# EAGLE design rauchmelder (EAGLE 6.3)
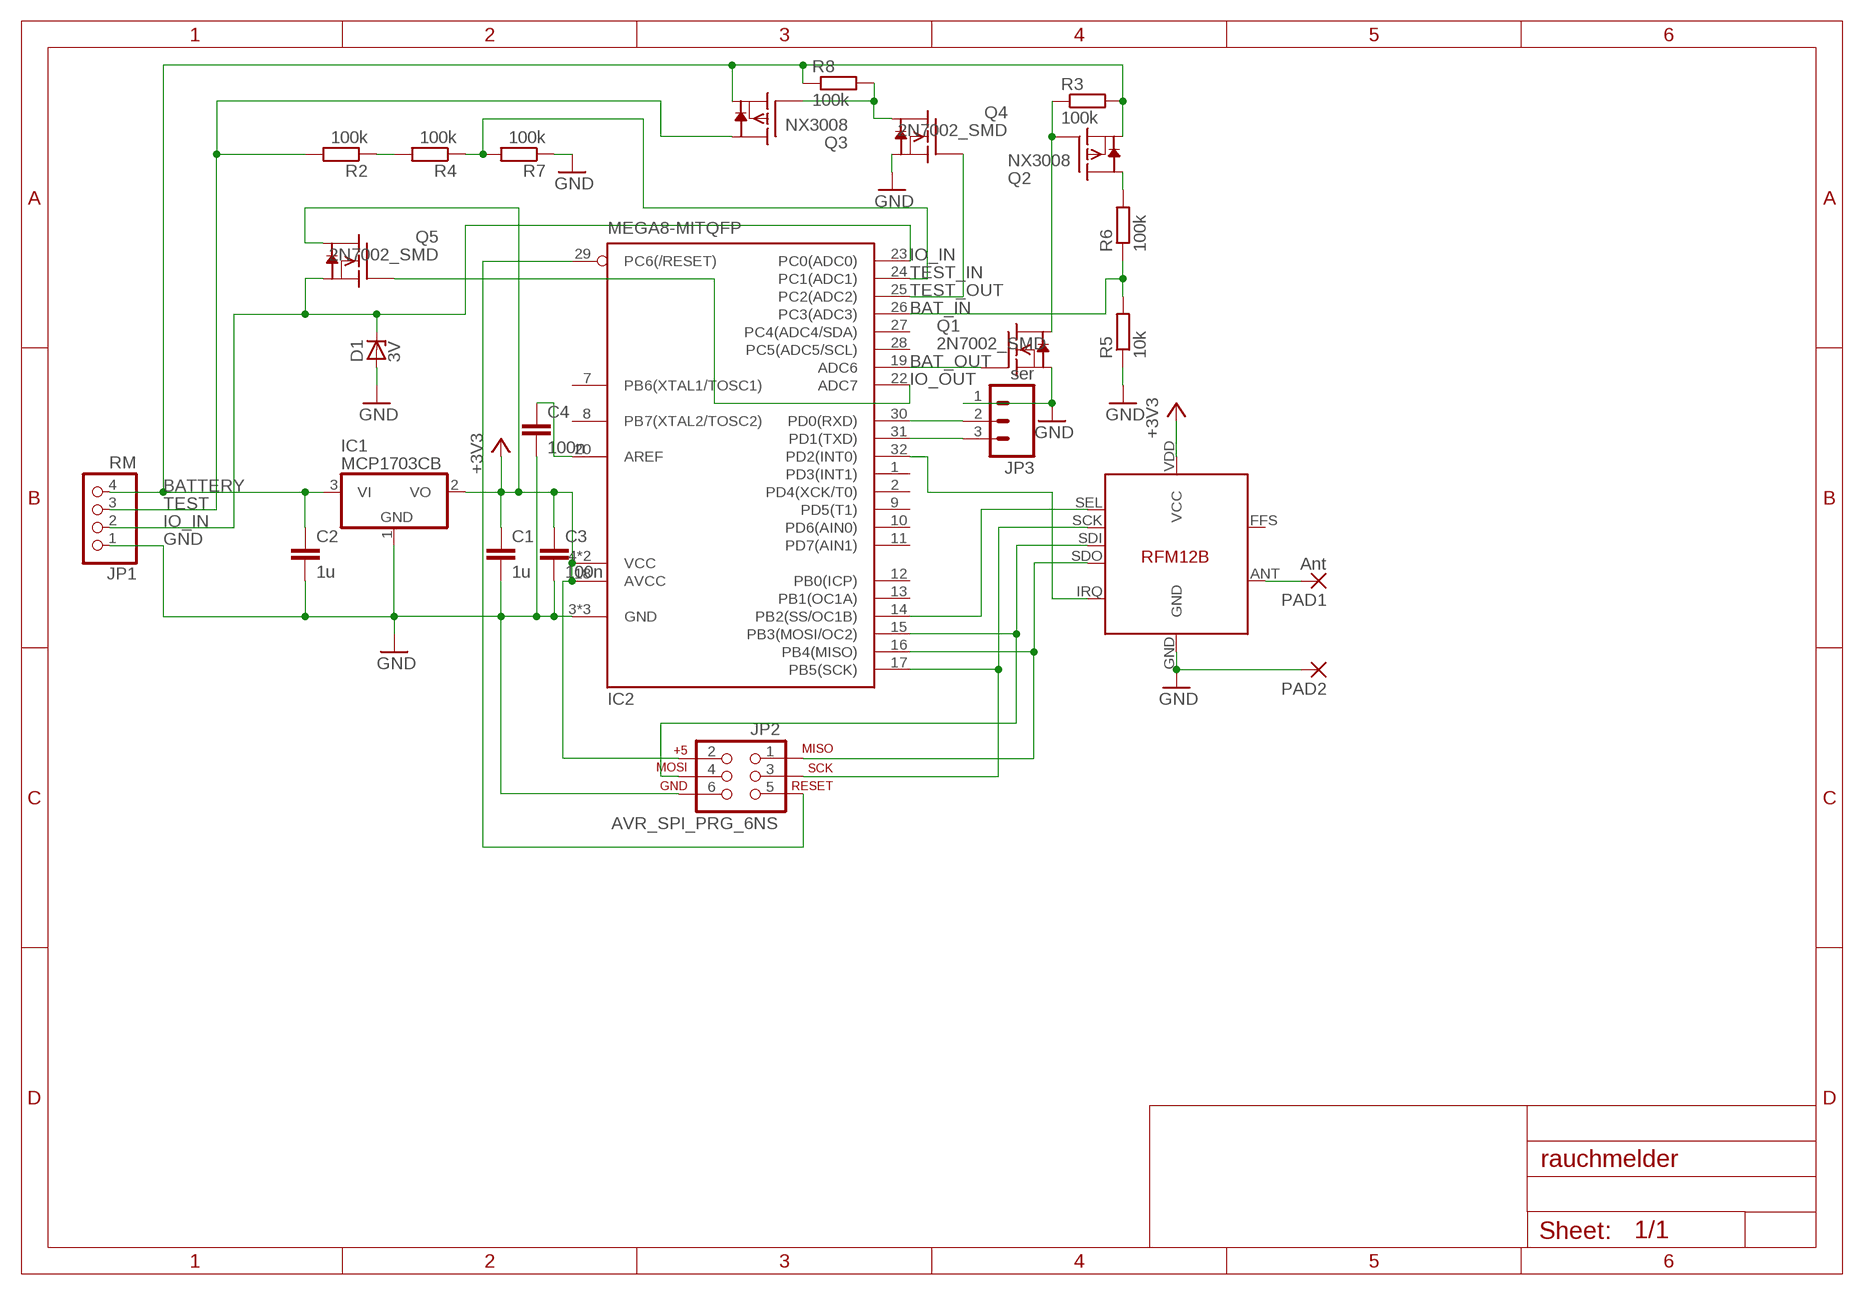
[diagram p0: schematic, sheet 1]

## Parts
C1  1u  C-EUC0603  [C0603]
C2  1u  C-EUC0603  [C0603]
C3  100n  C-EUC0603  [C0603]
C4  100n  C-EUC0603  [C0603]
D1  3V  ZENER-DIODESOD80C  [SOD80C]
IC1  MCP1703CB  [SOT23]
IC2  MEGA8-MITQFP  [TQFP32-08]
IC3  RFM12B  [RFM12B]
JP1  RM  PINHD-1X4  [1X04]
JP2  AVR_SPI_PRG_6NS  [2X3-NS]
JP3  ser  M03PTH  [1X03]
PAD1  Ant  1,6/0,8  [1,6/0,8]
PAD2  1,6/0,8  [1,6/0,8]
Q1  2N7002_SMD  [SOT23]
Q2  NX3008  [SOT23]
Q3  NX3008  [SOT23]
Q4  2N7002_SMD  [SOT23]
Q5  2N7002_SMD  [SOT23]
R2  100k  R-EU_R0603  [R0603]
R3  100k  R-EU_R0603  [R0603]
R4  100k  R-EU_R0603  [R0603]
R5  10k  R-EU_R0603  [R0603]
R6  100k  R-EU_R0603  [R0603]
R7  100k  R-EU_R0603  [R0603]
R8  100k  R-EU_R0603  [R0603]

## Nets
+3V3 [power]: C1.1 C3.1 IC1.2(VO) IC2.4(VCC) IC2.6(VCC) IC2.18(AVCC) IC3.VDD(VCC) JP2.2 Q5.3(D)
BAT_IN: IC2.26(PC3(ADC3)) R5.2 R6.1
BAT_OUT: IC2.19(ADC6) Q1.1(G)
BATTERY: C2.1 IC1.3(VI) JP1.4 Q2.2(S) Q3.2(S) R3.2 R8.1
GND [power]: C1.2 C2.2 C3.2 C4.2 D1.A IC1.1(GND) IC2.3(GND) IC2.5(GND) IC2.21(GND) IC3.GND JP1.1 JP2.6 JP3.1 PAD2.1(P) Q1.2(S) Q4.2(S) R5.1 R7.1
IO_IN: D1.C IC2.23(PC0(ADC0)) JP1.2 Q5.2(S)
IO_OUT: IC2.22(ADC7) Q5.1(G)
N$1: R2.1 R4.2
N$3: IC2.29(PC6(/RESET)) JP2.5
N$4: Q2.3(D) R6.2
N$5: IC2.16(PB4(MISO)) IC3.SDO JP2.1
N$6: IC2.15(PB3(MOSI/OC2)) IC3.SDI JP2.4
N$7: IC2.17(PB5(SCK)) IC3.SCK JP2.3
N$8: IC2.14(PB2(SS/OC1B)) IC3.SEL
N$9: IC2.32(PD2(INT0)) IC3.IRQ
N$11: Q1.3(D) Q2.1(G) R3.1
N$13: C4.1 IC2.20(AREF)
N$14: IC2.30(PD0(RXD)) JP3.2
N$15: IC2.31(PD1(TXD)) JP3.3
N$16: IC3.ANT PAD1.1(P)
N$17: Q3.1(G) Q4.3(D) R8.2
TEST: JP1.3 Q3.3(D) R2.2
TEST_IN: IC2.24(PC1(ADC1)) R4.1 R7.2
TEST_OUT: IC2.25(PC2(ADC2)) Q4.1(G)
Unconnected: IC2.1(PD3(INT1)) IC2.2(PD4(XCK/T0)) IC2.7(PB6(XTAL1/TOSC1)) IC2.8(PB7(XTAL2/TOSC2)) IC2.9(PD5(T1)) IC2.10(PD6(AIN0)) IC2.11(PD7(AIN1)) IC2.12(PB0(ICP)) IC2.13(PB1(OC1A)) IC2.27(PC4(ADC4/SDA)) IC2.28(PC5(ADC5/SCL)) IC3.FFS

## Library data of the parts
C1-C4 = rcl:C-EU: CAPACITOR, European symbol; OC_NEWARK: unknown
D1 = diode:ZENER-DIODE: Z-Diode; OC_FARNELL: 1757827
IC1 = rauchmelder:MCP1703: 250 mA, 16V, Low Quiescent Current LDO Regulator Source: http://ww1.microchip.com/downloads/en/DeviceDoc/22049b.pdf; OC_FARNELL: 1439518; OC_NEWARK: unknown
IC2 = rauchmelder:MEGA8-MI: MICROCONTROLLER 8 Kbytes FLASH, 1 kbytes SRAM, 512 bytes EEPROM, USART, 6-channel 10 bit ADC, 2-channel 8 bit ADC Pin compatible with Atmega48, ATMega88, ATMega168 Source: avr.lbr; OC_FARNELL: 1841614; OC_NEWARK: unknown
IC3 = rauchmelder:RFM12B; MPN: RFM12B-868-S1; OC_NEWARK: 40T1934
JP1 = pinhead:PINHD-1X4: PIN HEADER; OC_NEWARK: unknown
JP2 = rauchmelder:AVR_SPI_PRG_6: AVR ISP 6 Pin This is the reduced ISP connector for AVR programming. Common on Arduino. This footprint will take up less PCB space and can be used with a 10-pin to 6-pin adapter such as SKU: BOB-08508; OC_NEWARK: unknown
JP3 = rauchmelder:M03: Header 3 Standard 3-pin 0.1" header. Use with straight break away headers (SKU : PRT-00116), right angle break away headers (PRT-00553), swiss pins (PRT-00743), machine pins (PRT-00117), and female headers (PRT-00115). Molex polarized connector foot print use with SKU : PRT-08232 with associated crimp pins and housings.; OC_NEWARK: unknown
PAD1 PAD2 = rauchmelder:1,6/0,8: THROUGH-HOLE PAD; OC_NEWARK: unknown
Q1 Q4 Q5 = landroid:2N7002: N-Channel Enhancement MOSFET 60 V; 115 mA; 1.2…14 Ohm; OC_FARNELL: 1829184; OC_NEWARK: unknown
Q2 Q3 = rauchmelder:NX3008: Small P-channel MOSFET; MPN: NX3008NBK; OC_FARNELL: 2069541; OC_NEWARK: 75T7841
R2-R8 = rcl:R-EU_: RESISTOR, European symbol; OC_NEWARK: unknown

## Board
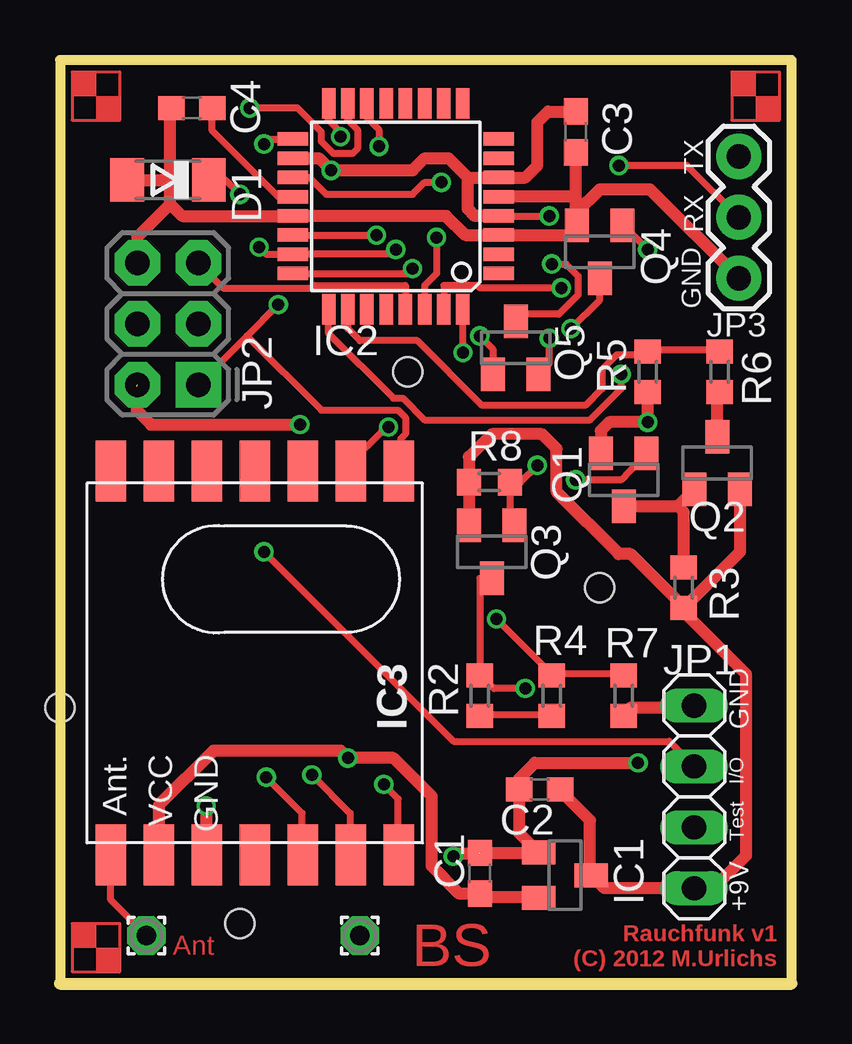
[diagram p1: board, top side]
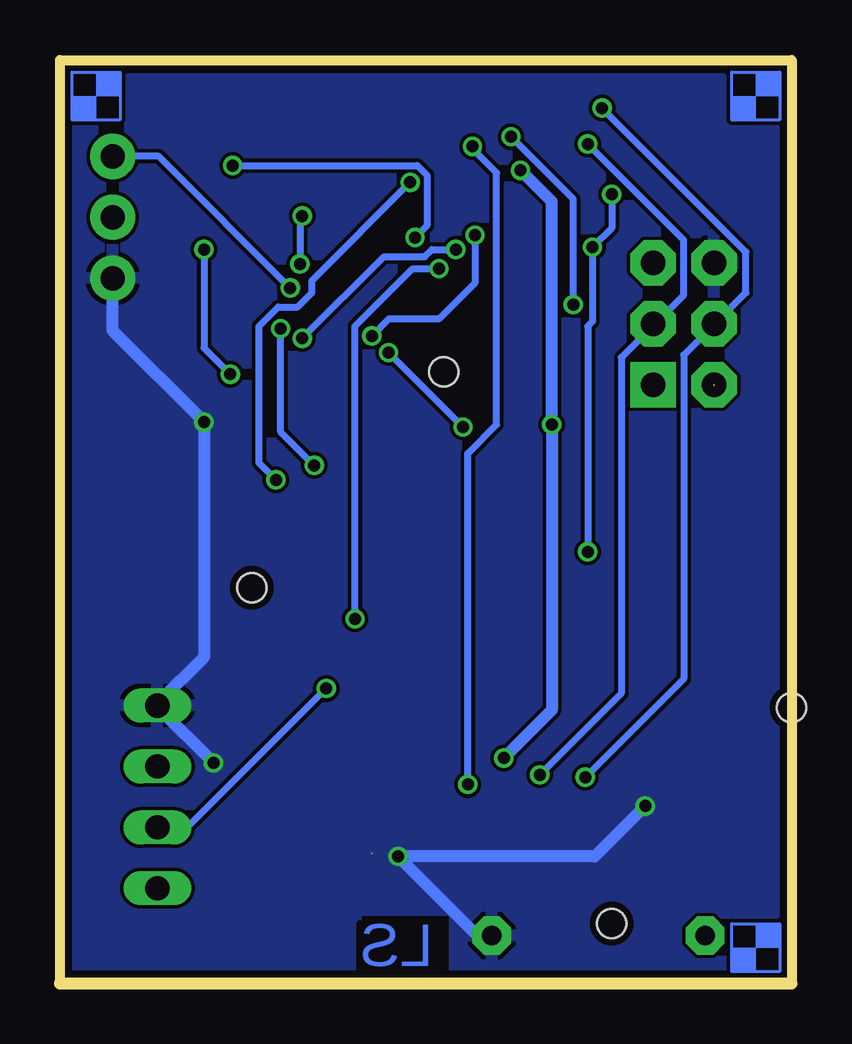
[diagram p2: board, bottom side, seen from below]

Size 30.5 x 38.5 mm. Coordinates in mm from the lower left corner, seen from the top.
Outline: 30.5,0 30.5,38.5 0,38.5 0,0 30.5,0
Copper layers (1*16): Top 0.035mm / dielectric 1.5mm / Bottom 0.035mm
Design rules "PCB-POOL Standard *": minimum track width 0.3mm, minimum drill 0.5mm, track to track 0.15mm, track to pad 0.15mm, pad to pad 0.15mm, via to via 0.15mm, smd to smd 0.15mm, copper to edge 0.3mm, drill to drill 0.2mm, minimum pad ring 0.2mm, minimum via ring 0.15mm, stop-mask expansion 0.075mm, vias tented up to drill 0mil, thermal gap 0.2mm
Holes 1.2 mm at 7.5,2.5 22.5,16.5 14.5,25.5 0,11.5
bRestrict: area 14.3,0.5 to 17.9,2.8

### Footprints (pad centres in the part's own frame; a part is rotated, then mirrored left to right if it is on the bottom)
C0603 = smd 1.1 x 1: 1 -0.85,0; 2 0.85,0
SOD80C = smd 1.4 x 1.8: A 1.7,0; C -1.7,0
SOT23 = smd 1 x 1.4: 1 -0.95,-1.1; 2 0.95,-1.1; 3 0,1.1
TQFP32-08 = smd 1.27 x 0.559: 1 -4.293,2.8; 2 -4.293,2; 3 -4.293,1.2; 4 -4.293,0.4; 5 -4.293,-0.4; 6 -4.293,-1.2; 7 -4.293,-2; 8 -4.293,-2.8; 17 4.293,-2.8; 18 4.293,-2; 19 4.293,-1.2; 20 4.293,-0.4; 21 4.293,0.4; 22 4.293,1.2; 23 4.293,2; 24 4.293,2.8 | smd 0.559 x 1.27: 9 -2.8,-4.293; 10 -2,-4.293; 11 -1.2,-4.293; 12 -0.4,-4.293; 13 0.4,-4.293; 14 1.2,-4.293; 15 2,-4.293; 16 2.8,-4.293; 25 2.8,4.293; 26 2,4.293; 27 1.2,4.293; 28 0.4,4.293; 29 -0.4,4.293; 30 -1.2,4.293; 31 -2,4.293; 32 -2.8,4.293
RFM12B = smd 2.54 x 1.27: ANT 8,-6; FFS -8,2; GND 8,-2; IRQ -8,4; P$8 -8,0; P$9 -8,-2; P$10 -8,-4; P$12 -8,-6; P$16 8,0; SCK 8,4; SDI 8,2; SDO -8,6; SEL 8,6; VDD 8,-4
1X04 = drill 1.016 long: 1 -3.81,0; 2 -1.27,0; 3 1.27,0; 4 3.81,0
2X3-NS = drill 1.016 pad 1.88 square: 1 -2.54,-1.27 | drill 1.016 pad 1.88 octagon: 2 -2.54,1.27; 3 0,-1.27; 4 0,1.27; 5 2.54,-1.27; 6 2.54,1.27
1X03 = drill 1.016 pad 1.88: 1 0,0; 2 2.54,0; 3 5.08,0
1,6/0,8 = drill 0.813 pad 1.6 octagon: 1 0,0
R0603 = smd 1 x 1.1: 1 -0.85,0; 2 0.85,0

### Placement (x,y rotation side)
C1  17.5,4.6 90 top
C2  20,8.1 180 top
C3  21.5,35.5 270 top
C4  5.5,36.5 180 top
D1  4.5,33.5 180 top
IC1  21.05,4.52 270 top
IC2  14,32.4 180 top
IC3  8.12,13.36 270 top
JP1  26.44,7.78 270 top
JP2  4.5,27.5 90 top
JP3  28.3,29.4 90 top
PAD1  3.6,2 0 top
PAD2  12.5,2 0 top
Q1  23.5,21 180 top
Q2  27.4,21.7 0 top
Q3  18,18 180 top
Q4  22.5,30.5 180 top
Q5  19,26.5 0 top
R2  17.5,12 90 top
R3  26,16.5 270 top
R4  20.5,12 270 top
R5  24.5,25.5 90 top
R6  27.5,25.5 270 top
R7  23.5,12 90 top
R8  17.9,20.9 0 top
U$1  [FIDUCIAL]  1.5,37 0 top
U$2  [FIDUCIAL]  1.5,1.5 0 top
U$3  [FIDUCIAL]  29,37 0 top

### Tracks (layer width: path | path; a pad name or v marks a point on that pad's centre or on a via)
+3V3  (via drill 0.5)  (1 unrouted)
  Top 0.3: 21.5,36.3 C3.1 | 10.3,34.4 IC2.18 | 18.2,32 IC2.4 v20.4,32 | 19.9,3.6 IC1.2 | 4.1,5.5 IC3.VDD | v20.5,30 21.1,30 21.6,29.5 21.6,28.7 20.8,27.9 19.3,27.9 Q5.3
  Top 0.5: v10,23.3 3.8,23.3 3.2,23.9 3.2,24.9 | 17,33.6 16.2,34.4 15.2,34.4 14.7,33.9 v11.3,33.9 10.8,34.4 10.3,34.4 | 17,33.6 IC2.6 19.4,33.6 19.9,34.1 19.9,35.9 20.35,36.35 C3.1 | IC2.4 17.3,32 17,32.3 17,33.6 | IC3.VDD 4.12,7.42 6.4,9.7 11.7,9.7 v12,9.4 13.9,9.4 15.5,7.8 15.5,4.9 16.65,3.75 C1.1 17.65,3.6 19.9,3.6
  Bottom 0.3: v20.4,32 20.5,31.9 v20.5,30
  Bottom 0.5: v11.3,33.9 10,32.6 v10,23.3 10,11.4 v12,9.4
BAT_IN
  Top 0.3: R6.1 27.5,26.4 24.5,26.4 R5.2 24.4,26.3 24.3,26.2 23.2,26.2 22.6,25.6 22.6,24.8 21.9,24.1 17.6,24.1 14.9,26.8 12.5,26.8 12,27.3 IC2.26
BAT_OUT  (via drill 0.5)
  Top 0.3: v21.5,21 23.4,21 Q1.1 | IC2.19 10.4,33.6 11.1,32.9 14.7,32.9 15.2,33.4 v15.9,33.4
  Bottom 0.3: v15.9,33.4 20,29.3 20,28.8 20.6,28.2 21.4,28.2 22.2,27.4 22.2,21.7 v21.5,21
BATTERY
  Top 0.3: 22.1,4.6 IC1.3 | 17.1,19.1 Q3.2 | 26,15.7 R3.2 | 25.9,15.8 R3.2 | 26,15.5 R3.2
  Top 0.5: 22.1,4.6 22.1,6.8 20.85,8.05 C2.1 | 25.9,15.8 23.8,17.9 23.3,17.9 20.7,20.5 20.7,22.3 20.1,22.9 18,22.9 17.05,21.95 R8.1 Q3.2 | 26,15.5 28.6,12.9 28.6,5.33 27.24,3.97 JP1.4 22.7,3.97 IC1.3 | Q2.2 28.35,18 R3.2
GND  (via drill 0.5)  (1 unrouted)
  Top 0.3: 23.5,11.2 R7.1 | 26.4,11.5 JP1.1 | 19.9,5.4 IC1.1 | 6.2,5.3 IC3.GND | 4.6,36.5 C4.2 | 4.2,33.4 4.2,33.5 | 21.5,31.6 Q4.2 | 21.3,31.4 21.4,31.5 Q4.2 | 24.5,24.6 R5.1 24.6,24.7 | 22.6,22.1 Q1.2 | 21.7,31.6 Q4.2
  Top 0.5: 23.5,11.2 23.8,11.5 26.4,11.5 | v24.1,9.2 19.8,9.2 19.15,8.55 C2.2 19.15,6.27 IC1.1 19.93,5.45 C1.2 | 4.6,33.5 4.6,36.5 | D1.A 4.2,33.5 4.6,33.5 | 21.5,31.6 21.5,32.8 | 21.5,32.8 C3.2 | IC2.3 | 21.5,32.8 IC2.5 | JP3.1 24.6,33.1 22.5,33.1 21.55,32.15 Q4.2 21.15,31.2 IC2.3 | IC2.3 16.9,31.2 16.1,32 IC2.21 5.1,32 4.6,32.5 | 4.6,32.5 4.6,33.5 | JP2.6 3.23,31.13 4.6,32.5 | R5.1 v24.5,23.4 22.9,23.4 22.55,23.05 Q1.2 | v6.1,7.4 6.1,5.36 IC3.GND | 17.5,5.4 16.5,5.4 v16.4,5.3
  Bottom 0.3: 26.4,11.7 JP1.1
  Bottom 0.5: PAD2.1 13.1,2 v16.4,5.3 8.2,5.3 v6.1,7.4 | v24.1,9.2 26.4,11.5 JP1.1 | 26.4,11.7 24.5,13.6 v24.5,23.4 28.3,27.2 JP3.1
  pour Bottom: 0.7,35.6 2.9,35.6 2.9,37.7 27.6,37.7 27.6,35.6 29.8,35.6 29.8,0.7 2.9,0.7 2.9,2.9 0.7,2.9
IO_IN  (via drill 0.5)
  Top 0.3: v7.5,32.9 6.9,33.5 D1.C | IC2.23 | v8.5,18 16.4,10.1 25.4,10.1 26.4,9.1 JP1.2 | v8.3,30.7 8.6,30.4 IC2.23 | Q5.2 20.4,25.85 v20.4,26.9 | v14,30.6 13.8,30.4 IC2.23
  Bottom 0.3: v7.5,32.9 7.5,31.5 v8.3,30.7 8.3,27.6 8.5,27.4 v8.5,18 | v20.4,26.9 17,30.3 15.3,30.3 15,30.6 v14,30.6
IO_OUT  (via drill 0.5)
  Top 0.3: IC2.22 v13.2,31.2 | v17.5,27 18.05,26.45 Q5.1
  Bottom 0.3: v13.2,31.2 13.2,29.2 14.7,27.7 16.8,27.7 v17.5,27
N$1
  Top 0.3: R2.1 17.5,11.2 20.5,11.2 R4.2
N$3
  Top 0.3: IC2.29 14.4,29.1 10.6,29.1 10.5,29 6.8,29 5.8,30 JP2.5
N$4
  Top 0.5: Q2.3 27.4,24.55 R6.2
N$5  (via drill 0.5)
  Top 0.3: v11.7,35.3 11.7,35.5 11.2,36 IC2.16 | 7.8,27 5.8,25 JP2.1 | 7.8,27 v9.1,28.3 | 7.8,27 10.9,23.9 14.1,23.9 14.4,23.6 14.4,22.9 14.2,22.7 14.2,21.4 IC3.SDO
  Bottom 0.3: v11.7,35.3 9.1,32.7 v9.1,28.3
N$6  (via drill 0.5)
  Top 0.3: IC3.SDI 10.1,5.4 10.1,7.1 v8.6,8.6 | IC2.15 12,36 12.4,35.6 12.4,34.8 12.2,34.6 11.4,34.6 10.9,35.1 10.9,35.5 9.9,36.5 v7.9,36.5
  Bottom 0.3: v7.9,36.5 1.9,30.5 1.9,28.8 3.2,27.5 JP2.4 3.3,27.4 4.5,26.2 4.5,12.7 v8.6,8.6
N$7  (via drill 0.5)
  Top 0.3: IC2.17 8.7,35.2 v8.5,35 | v10.5,8.7 12.1,7.1 12.1,5.4 IC3.SCK
  Bottom 0.3: v8.5,35 4.5,31 4.5,28.7 5.7,27.5 JP2.3 5.8,27.4 7.1,26.1 7.1,12.1 v10.5,8.7
N$8  (via drill 0.5)
  Top 0.3: IC3.SEL 14.1,5.4 14.1,7.7 v13.5,8.3 | IC2.14 12.8,36.1 13.3,35.6 v13.3,34.9
  Bottom 0.3: v13.5,8.3 13.5,22.1 12.3,23.3 12.3,33.8 13.3,34.8 v13.3,34.9
N$9  (via drill 0.5)
  Top 0.3: v16.8,26.3 IC2.32 | v13.7,23.2 13.5,23 13.4,23 12.2,21.8 12.2,21.4 IC3.IRQ
  Bottom 0.3: v13.7,23.2 v16.8,26.3
N$11
  Top 0.5: Q1.3 25.75,19.9 | 25.75,19.9 Q2.1 | R3.1 26,19.65 25.75,19.9
N$13
  Top 0.3: IC2.20 9.1,32.8 6.35,35.55 C4.1 6.4,36.5
N$14  (via drill 0.5)
  Top 0.3: v15.7,31.1 15.7,29.6 15.2,29.1 IC2.30 | v23.3,34.1 26.14,34.1 JP3.2
  Bottom 0.3: v15.7,31.1 15.2,31.6 15.2,33.7 15.6,34.1 v23.3,34.1
N$15  (via drill 0.5)
  Top 0.3: IC2.31 16,29.1 17.4,29.1 17.5,29 v20.9,29
  Bottom 0.3: v20.9,29 26.38,34.48 JP3.3
N$16
  Top 0.3: PAD1.1 2.12,3.48 IC3.ANT
N$17  (via drill 0.5)
  Top 0.3: 18.9,19.1 Q3.1 18.75,19.3 R8.2 19.2,20.9 v19.9,21.6 | v21.3,27.3 22.5,28.5 Q4.3
  Bottom 0.3: v19.9,21.6 21.3,23 v21.3,27.3
TEST  (via drill 0.5)
  Top 0.3: Q3.3 17.5,16.9 R2.2 17.6,12.8 18.1,12.3 v19.4,12.3
  Bottom 0.3: v19.4,12.3 25.19,6.51 JP1.3
TEST_IN  (via drill 0.5)
  Top 0.3: R7.2 23.5,12.9 20.5,12.9 R4.1 20.4,13 v18.2,15.2 | IC2.24 14.5,29.6 v14.7,29.8
  Bottom 0.3: v14.7,29.8 15.8,29.8 18.2,27.4 v18.2,15.2
TEST_OUT  (via drill 0.5)
  Top 0.3: IC2.25 11.2,27.1 13.9,24.4 14.3,24.4 15.2,23.5 22.1,23.5 23.4,24.8 v23.4,25.4 | v24.5,30.6 23.5,31.6 Q4.1
  Bottom 0.3: v23.4,25.4 24.5,26.5 v24.5,30.6

### Text on the board
Top: BS | Ant | Rauchfunk v1 / (C) 2012 M.Urlichs
Bottom: LS
tNames: TX | RX | GND | GND | Test | I/O | +9V